# Altium schematic sheet Top Level.SchDoc
size A
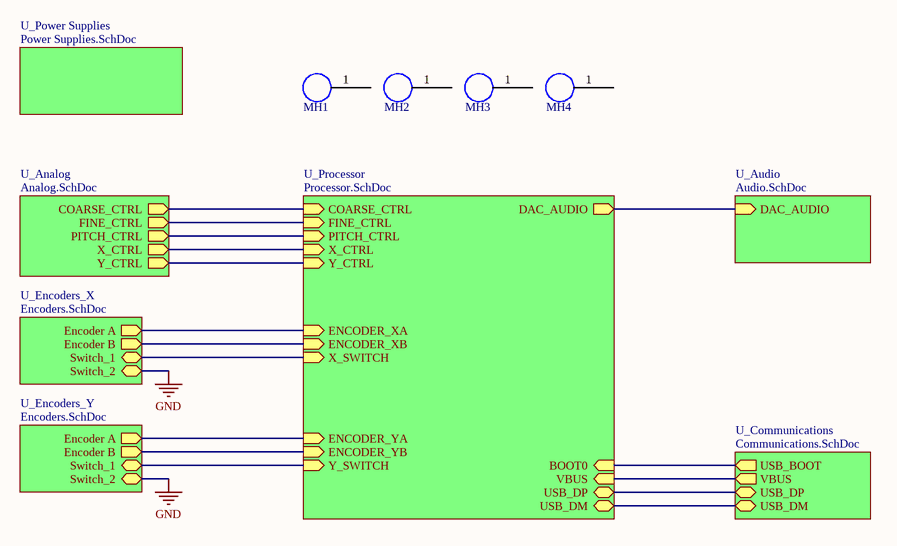
[diagram p0: Top Level.SchDoc]

## Parts
MH1  MH  [M2_P]  (value not drawn)
MH2  MH  [M2_P]  (value not drawn)
MH3  MH  [M2_P]  (value not drawn)
MH4  MH  [M2_P]  (value not drawn)

## Sub-sheets
U_Analog = Analog.SchDoc: COARSE_CTRL (out), FINE_CTRL (out), Y_CTRL (out), X_CTRL (out), PITCH_CTRL (out)
U_Audio = Audio.SchDoc: DAC_AUDIO (in)
U_Communications = Communications.SchDoc: VBUS (out), USB_DM (bidir), USB_DP (bidir), USB_BOOT (out)
U_Encoders_X = Encoders.SchDoc: Encoder B (out), Encoder A (out), Switch_1, Switch_2
U_Encoders_Y = Encoders.SchDoc: Encoder B (out), Encoder A (out), Switch_2, Switch_1
U_Power Supplies = Power Supplies.SchDoc: no entries
U_Processor = Processor.SchDoc: Y_SWITCH (in), X_SWITCH (in), ENCODER_XA (in), ENCODER_XB (in), ENCODER_YA (in), ENCODER_YB (in), DAC_AUDIO (out), PITCH_CTRL (in), FINE_CTRL (in), COARSE_CTRL (in), X_CTRL (in), Y_CTRL (in), USB_DM (bidir), VBUS (in), USB_DP (bidir), BOOT0 (in)

## Nets
GND: sheet U_Encoders_X/Switch_2, sheet U_Encoders_Y/Switch_2
(unnamed): sheet U_Encoders_X/Encoder B, sheet U_Processor/ENCODER_XB
(unnamed): sheet U_Encoders_X/Encoder A, sheet U_Processor/ENCODER_XA
(unnamed): sheet U_Encoders_X/Switch_1, sheet U_Processor/X_SWITCH
(unnamed): sheet U_Encoders_Y/Encoder B, sheet U_Processor/ENCODER_YB
(unnamed): sheet U_Encoders_Y/Encoder A, sheet U_Processor/ENCODER_YA
(unnamed): sheet U_Encoders_Y/Switch_1, sheet U_Processor/Y_SWITCH
(unnamed): sheet U_Analog/COARSE_CTRL, sheet U_Processor/COARSE_CTRL
(unnamed): sheet U_Analog/FINE_CTRL, sheet U_Processor/FINE_CTRL
(unnamed): sheet U_Analog/Y_CTRL, sheet U_Processor/Y_CTRL
(unnamed): sheet U_Analog/X_CTRL, sheet U_Processor/X_CTRL
(unnamed): sheet U_Analog/PITCH_CTRL, sheet U_Processor/PITCH_CTRL
(unnamed): sheet U_Communications/VBUS, sheet U_Processor/VBUS
(unnamed): sheet U_Communications/USB_DM, sheet U_Processor/USB_DM
(unnamed): sheet U_Communications/USB_DP, sheet U_Processor/USB_DP
(unnamed): sheet U_Communications/USB_BOOT, sheet U_Processor/BOOT0
(unnamed): sheet U_Processor/DAC_AUDIO, sheet U_Audio/DAC_AUDIO

Not connected (* = marked no-connect by the designer): MH1 1; MH2 1; MH3 1; MH4 1

## Library data of the parts
MH1-MH4 = MH: Mounting Hole